# Altium schematic sheet VLC_RX_Schem.SchDoc
size A3; SheetNumber: 1; SheetTotal: 1
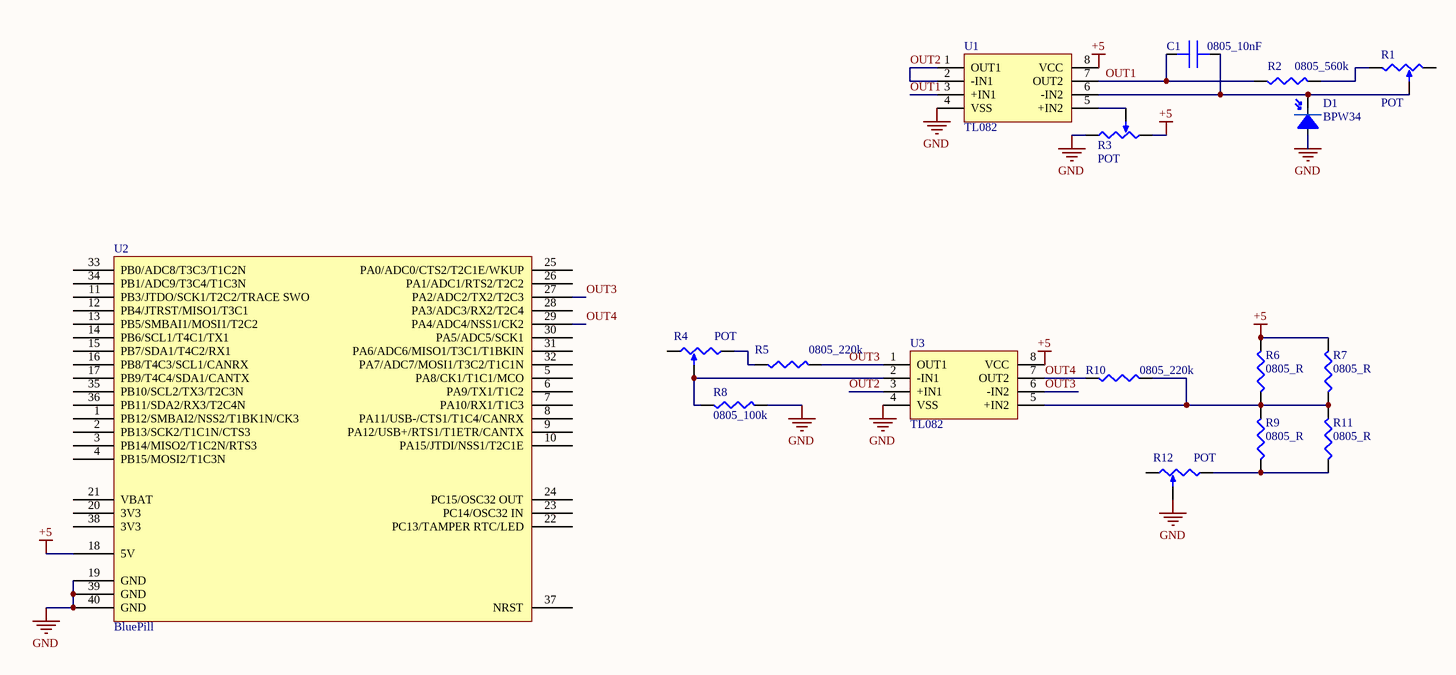
[diagram p0: VLC_RX_Schem.SchDoc]

## Parts
C1  0805_10nF  [C0805 - 0.1uf]
D1  BPW34  [BPW34]
R1  POT  [POT 3386P]
R2  0805_560k  [R0805]
R3  POT  [POT 3386P]
R4  POT  [POT 3386P]
R5  0805_220k  [R0805]
R6  0805_R  [R0805]
R7  0805_R  [R0805]
R8  0805_100k  [R0805]
R9  0805_R  [R0805]
R10  0805_220k  [R0805]
R11  0805_R  [R0805]
R12  POT  [POT 3386P]
U1  TL082  [SOP8]
U2  BluePill  [BluePill]
U3  TL082  [SOP8]

## Nets
+5: R3.1 R6.1 R7.1 U1.8(VCC) U2.18(5V) U3.8(VCC)
GND: D1.A(Anode) R3.2 R8.2 R12.3 U1.4(VSS) U2.19(GND) U2.39(GND) U2.40(GND) U3.4(VSS)
OUT1: C1.1 R2.1 U1.3(+IN1) U1.7(OUT2)
OUT2: U1.1(OUT1) U1.2(-IN1) U3.3(+IN1)
OUT3: R5.1 U2.27(PA2/ADC2/TX2/T2C3) U3.1(OUT1) U3.6(-IN2)
OUT4: R10.1 U2.29(PA4/ADC4/NSS1/CK2) U3.7(OUT2)
NetC1_2: C1.2 D1.K(Cathode) R1.3 U1.6(-IN2)
NetR1_2: R1.2 R2.2
NetR3_3: R3.3 U1.5(+IN2)
NetR4_2: R4.2 R5.2
NetR4_3: R4.3 R8.1 U3.2(-IN1)
NetR6_2: R6.2 R7.2 R9.1 R10.2 R11.1 U3.5(+IN2)
NetR9_2: R9.2 R11.2 R12.2

Not connected (* = marked no-connect by the designer): R1 1; R4 1; R12 1; U2 1(PB12/SMBAI2/NSS2/T1BK1N/CK3) 2(PB13/SCK2/T1C1N/CTS3) 3(PB14/MISO2/T1C2N/RTS3) 4(PB15/MOSI2/T1C3N) 5(PA8/CK1/T1C1/MCO) 6(PA9/TX1/T1C2) 7(PA10/RX1/T1C3) 8(PA11/USB-/CTS1/T1C4/CANRX) 9(PA12/USB+/RTS1/T1ETR/CANTX) 10(PA15/JTDI/NSS1/T2C1E) 11(PB3/JTDO/SCK1/T2C2/TRACE_SWO) 12(PB4/JTRST/MISO1/T3C1) 13(PB5/SMBAI1/MOSI1/T2C2) 14(PB6/SCL1/T4C1/TX1) 15(PB7/SDA1/T4C2/RX1) 16(PB8/T4C3/SCL1/CANRX) 17(PB9/T4C4/SDA1/CANTX) 20(3V3) 21(VBAT) 22(PC13/TAMPER_RTC/LED) 23(PC14/OSC32_IN) 24(PC15/OSC32_OUT) 25(PA0/ADC0/CTS2/T2C1E/WKUP) 26(PA1/ADC1/RTS2/T2C2) 28(PA3/ADC3/RX2/T2C4) 30(PA5/ADC5/SCK1) 31(PA6/ADC6/MISO1/T3C1/T1BKIN) 32(PA7/ADC7/MOSI1/T3C2/T1C1N) 33(PB0/ADC8/T3C3/T1C2N) 34(PB1/ADC9/T3C4/T1C3N) 35(PB10/SCL2/TX3/T2C3N) 36(PB11/SDA2/RX3/T2C4N) 37(NRST) 38(3V3)

## Library data of the parts
C1 = 0805 Capacitor
D1 = BPW34: PIN photodiode with high speed and high / radiant sensitivity in miniature, flat, top view, clear plastic / package. It is sensitive to visible and near infrared radiation. / BPW34S is packed in tubes, specifications like BPW34.
R2 R5-R11 = 0805 Resistor
U1 U3 = TL082: TL082CD SO-8 Operational Amplifier SMD IC
U2 = STM32 BluePill